# EAGLE design mSD-Bee_v10 (EAGLE 7.7.0)
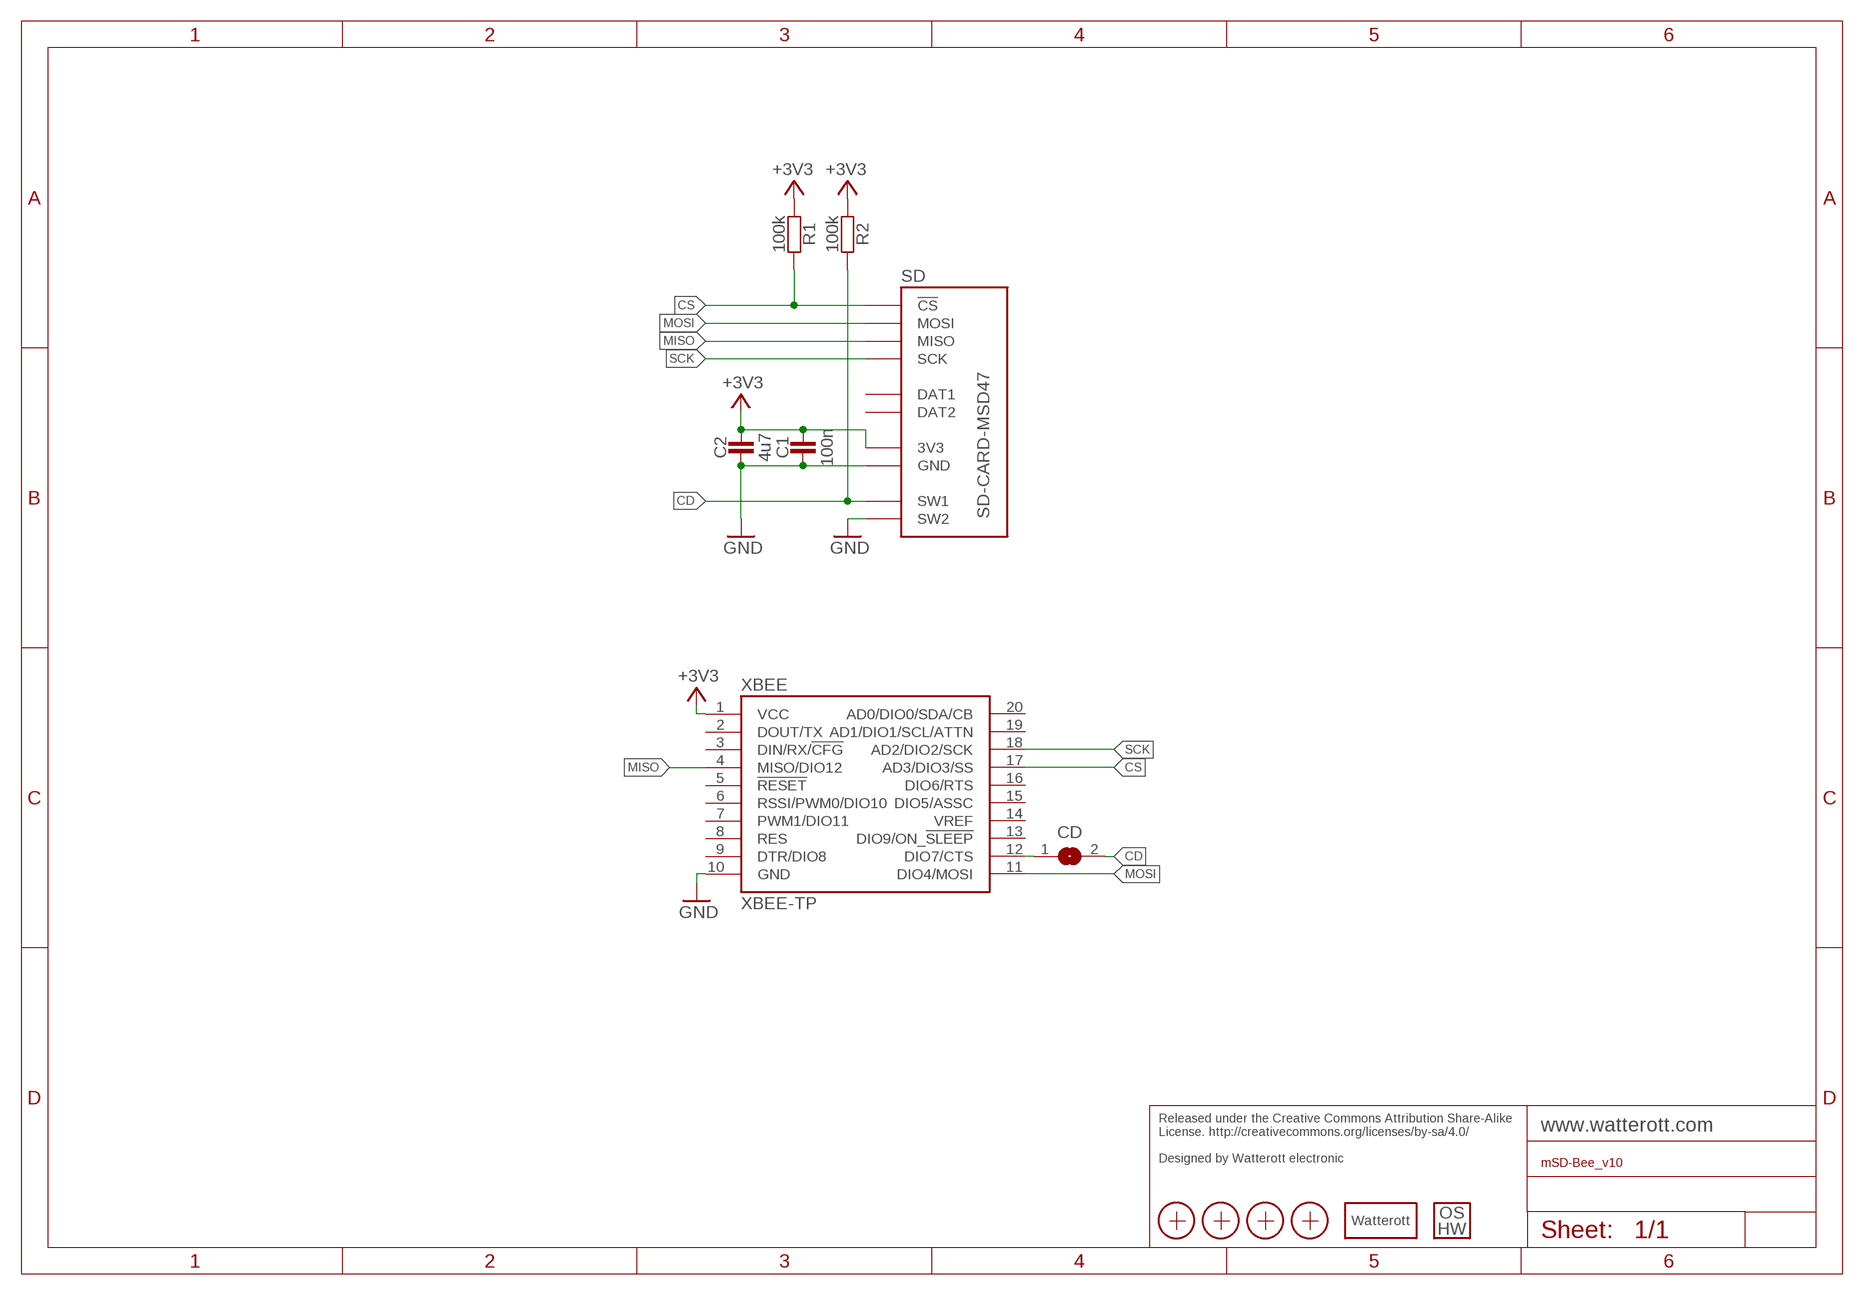
[diagram p0: schematic, sheet 1]

## Parts
C1  100n  CAPACITOR-0402  [C0402]
C2  4u7  CAPACITOR-0603  [C0603]
CD  JUMPER2-0603  [JUMPER2-0603]
LOGO3  LOGO_SPARK-2  [SPARK_2MM]
LOGO4  LOGO_OSHW-2  [OSHW_2MM]
R1  100k  RESISTOR-0402  [C0402]
R2  100k  RESISTOR-0402  [C0402]
SD  SD-CARD-MSD47  [SD_47309XXXX]
X1  PASSER-07  [PASSER_07MM]
X2  PASSER-07  [PASSER_07MM]
X3  PASSER-07  [PASSER_07MM]
X4  PASSER-07  [PASSER_07MM]
XBEE  XBEE-TP  [XBEE_TP]

## Nets
+3V3: C1.2 C2.2 R1.2 R2.2 SD.VCC(3V3) XBEE.1(VCC)
CD: CD.2 R2.1 SD.SW1
CS: R1.1 SD.CS(!CS) XBEE.17(AD3/DIO3/SS)
GND: C1.1 C2.1 SD.GND SD.GND@1(GND) SD.GND@2(GND) SD.SW2 XBEE.10(GND)
INT: CD.1 XBEE.12(DIO7/CTS)
MISO: SD.MISO XBEE.4(MISO/DIO12)
MOSI: SD.MOSI XBEE.11(DIO4/MOSI)
SCK: SD.SCK XBEE.18(AD2/DIO2/SCK)
Unconnected: SD.DAT1 SD.DAT2 XBEE.2(DOUT/TX) XBEE.3(DIN/RX/!CFG!) XBEE.5(!RESET!) XBEE.6(RSSI/PWM0/DIO10) XBEE.7(PWM1/DIO11) XBEE.8(RES) XBEE.9(DTR/DIO8) XBEE.13(DIO9/ON_!SLEEP!) XBEE.14(VREF) XBEE.15(DIO5/ASSC) XBEE.16(DIO6/RTS) XBEE.19(AD1/DIO1/SCL/ATTN) XBEE.20(AD0/DIO0/SDA/CB)

## Notes on the sheet
- Released under the Creative Commons Attribution Share-Alike 
  License. http://creativecommons.org/licenses/by-sa/4.0/
  
  Designed by Watterott electronic

## Library data of the parts
C1 C2 = we-rcl:CAPACITOR: Capacitors ...2.2uF @ 6.3V -> 0402 ...4.7uF @ 6.3V -> 0603 ...10uF @ 16V -> 0805 ...22uF @ 25V -> 1206
CD = we-rcl:JUMPER2: 2 Pin Jumpers
LOGO3 = we-symbol:LOGO_SPARK: Watterott electronic Logo
LOGO4 = we-symbol:LOGO_OSHW: Open-Source-Hardware Logo
R1 R2 = we-rcl:RESISTOR: Resistors all kinds in 0402 and 0603
SD = we-con:SD-CARD: SD-Card Sockets
X1-X4 = we-symbol:PASSER: Fiducial Markers
XBEE = we-board:XBEE: XBEE connector

## Board
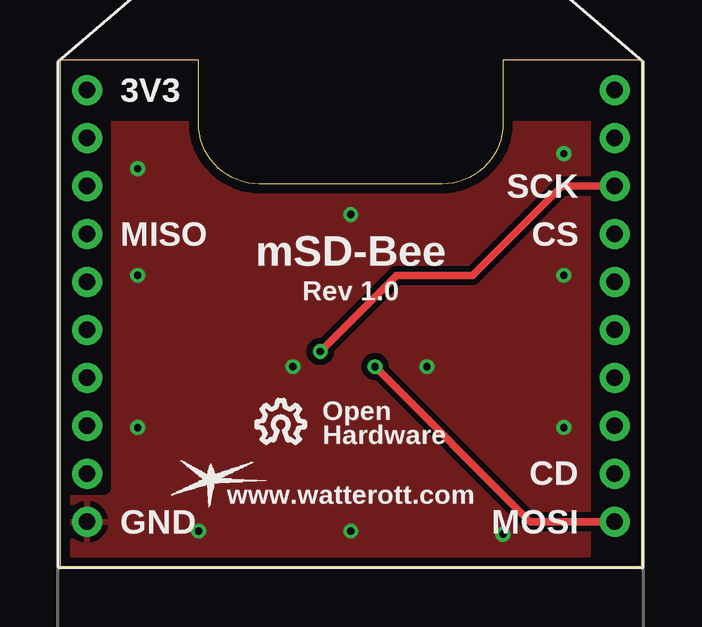
[diagram p1: board, top side]
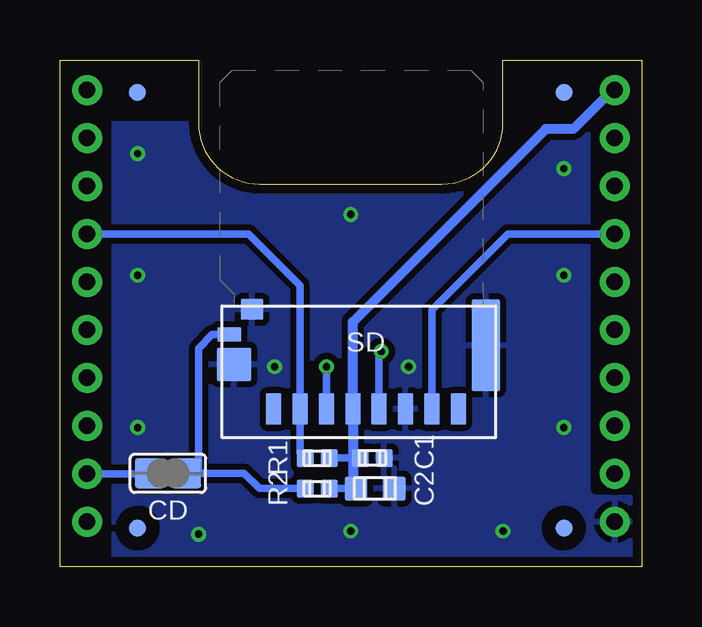
[diagram p2: board, bottom side, seen from below]

Size 24.25 x 21.12 mm. Coordinates in mm from the lower left corner, seen from the top.
Outline: 24.25,0 24.25,21.12 18.48,21.12 18.48,18.5 arc-90 15.94,15.96 8.31,15.96 arc-90 5.78,18.5 5.78,21.12 0,21.12 0,0 24.25,0
Copper layers (1*16): Top 0.035mm / dielectric 1.5mm / Bottom 0.035mm
Design rules "we-dru-2-layer": minimum track width 0.15mm, minimum drill 0.3mm, track to track 0.15mm, track to pad 0.15mm, pad to pad 0.15mm, via to via 0.15mm, smd to smd 0.1mm, copper to edge 0.4mm, drill to drill 0.2mm, minimum pad ring 0.18mm, minimum via ring 0.16mm, stop-mask expansion 0.1mm, vias tented up to drill 0.5mm, thermal gap 0.25mm
tRestrict: area 0.4,3.2 to 1.9,20.8; area 22.4,0.4 to 23.9,20.8
bRestrict: area 0.4,3.2 to 1.9,20.8; area 22.4,0.4 to 23.9,20.8

### Footprints (pad centres in the part's own frame; a part is rotated, then mirrored left to right if it is on the bottom)
C0402 = smd 0.75 x 0.7: 1 0,0.5; 2 0,-0.5
C0603 = smd 1 x 0.95: 1 0,0.8; 2 0,-0.8
JUMPER2-0603 = smd 1.25 x 1.25: 1 0,0.76; 2 0,-0.76
SD_47309XXXX = smd 0.65 x 1.3: CS 2.75,4.3; DAT1 -3.85,4.3; DAT2 3.85,4.3; GND -1.65,4.3; MISO -2.75,4.3; MOSI 1.65,4.3; SCK -0.55,4.3; VCC 0.55,4.3 | smd 1.2 x 3.8: GND@1 -5,1.65 | smd 1.45 x 1.4: GND@2 5.5,2.45 | smd 1 x 0.6: SW1 5.7,1.2 | smd 0.95 x 0.85: SW2 4.75,0.15
PASSER_07MM = smd 0.7 x 0.7: X 0,0
XBEE_TP = drill 0.7 pad 1.25: 1 -11,9; 2 -11,7; 3 -11,5; 4 -11,3; 5 -11,1; 6 -11,-1; 7 -11,-3; 8 -11,-5; 9 -11,-7; 10 -11,-9; 11 11,-9; 12 11,-7; 13 11,-5; 14 11,-3; 15 11,-1; 16 11,1; 17 11,3; 18 11,5; 19 11,7; 20 11,9

### Placement (x,y rotation side)
C1  11.24,4.53 270 bottom
C2  11.11,3.25 270 bottom
CD  19.75,3.89 90 bottom
LOGO3  6.28,3.64 0 top
LOGO4  9.2,6.05 0 top
R1  13.52,4.53 90 bottom
R2  13.52,3.25 90 bottom
SD  11.49,10.88 180 bottom
X1  3.23,1.6 0 bottom
X2  3.23,19.77 0 bottom
X3  21.02,1.6 0 bottom
X4  21.02,19.77 0 bottom
XBEE  12.12,10.88 0 top

### Tracks (layer width: path | path; a pad name or v marks a point on that pad's centre or on a via)
+3V3
  Bottom 0.305: R1.2 12.04,4.53 | R2.2 12.08,3.25 12.04,3.3
  Bottom 0.406: XBEE.1 1.22,19.88 2.85,18.24 4,18.24 12.04,10.2 SD.VCC 12.04,4.53 | 12.04,4.53 12.04,3.3 12,3.25 C2.2 | C1.2 12.04,4.53
CD
  Bottom 0.305: SD.SW1 17.9,9.68 18.48,9.1 18.48,4.02 18.6,3.89 | R2.1 15.94,3.25 16.57,3.89 18.6,3.89 | 18.6,3.89 CD.2
CS
  Bottom 0.305: XBEE.17 16.39,13.88 14.24,11.72 SD.CS 14.24,4.74 R1.1
GND  (via drill 0.3)
  other vias: 9.71,8.34 18.48,1.35 15.3,8.34 12.12,14.69 3.23,16.59 21.02,17.23 21.02,5.79 21.02,12.14 3.23,5.79 3.23,12.14 5.78,1.48 12.12,1.48
  pour Top (isolate 0.254): 24.25,0 0,0 0,18.48 24.25,18.48
  pour Bottom (isolate 0.254): 0,0 24.25,0 24.25,18.48 0,18.48
INT
  Bottom 0.305: XBEE.12 20.52,3.88 CD.1
MISO
  Bottom 0.305: XBEE.4 5.57,13.88 8.74,10.7 SD.MISO
MOSI  (via drill 0.3)
  Top 0.305: XBEE.11 19.6,1.88 v13.14,8.34
  Bottom 0.305: SD.MOSI v13.14,8.33 v13.14,8.34
SCK  (via drill 0.3)
  Top 0.305: XBEE.18 20.94,15.88 17.2,12.14 14.03,12.14 v10.86,8.97
  Bottom 0.305: SD.SCK 10.94,8.88 v10.86,8.97

### Text on the board
tPlace: 3V3 | SCK | MISO | CS | mSD-Bee | Rev 1.0 | Open | Hardware | CD | www.watterott.com | GND | MOSI
Reference: Silkscreen: 21 tPlace